# EAGLE design button (EAGLE 7.4.0)
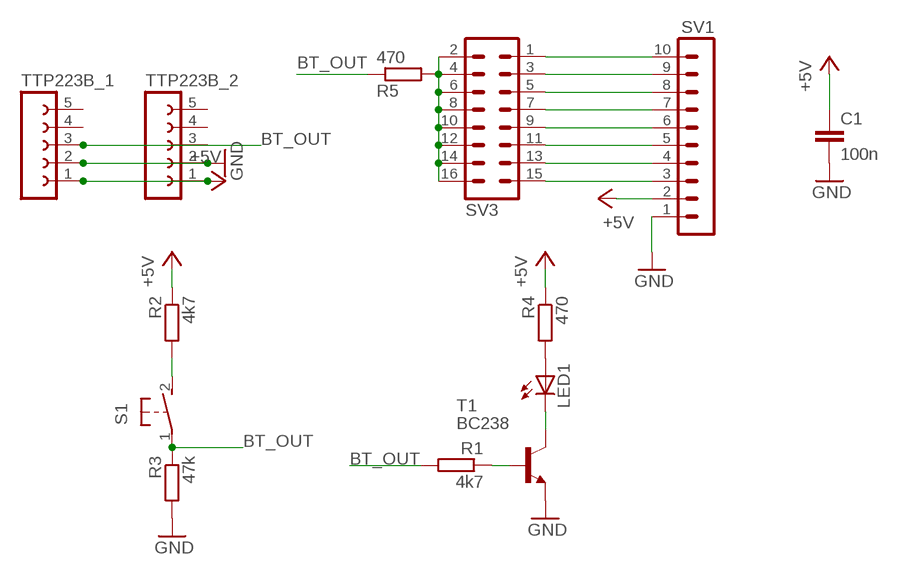
[diagram p0: schematic, sheet 1]

## Parts
C1  100n  C-EU025-024X044  [C025-024X044]
LED1  LED5MM  [LED5MM]
R1  4k7  R-EU_0309/10  [0309/10]
R2  4k7  R-EU_R0805  [R0805]
R3  47k  R-EU_0414/15  [0414/15]
R4  470  R-EU_0207/7  [0207/7]
R5  470  R-EU_0207/7  [0207/7]
S1  31-XX  [B3F-31XX]
SV1  MA10-1W  [MA10-1W]
SV3  MA08-2  [MA08-2]
T1  BC238  -NPN-TO5  [TO5]
TTP223B_1  FE05-1  [FE05-1]
TTP223B_2  FE05W  [FE05W]

## Nets
+5V: C1.1 R2.1 R4.1 SV1.2 TTP223B_1.1 TTP223B_2.1
BT_OUT: R1.2 R3.1 R5.1 S1.1(P) TTP223B_1.3 TTP223B_2.3
GND: C1.2 R3.2 SV1.1 T1.1(E) TTP223B_1.2 TTP223B_2.2
N$1: R5.2 SV3.2 SV3.4 SV3.6 SV3.8 SV3.10 SV3.12 SV3.14 SV3.16
N$2: LED1.K(C) T1.3(C)
N$3: R1.1 T1.2(B)
N$4: R2.2 S1.2(S)
N$5: LED1.A R4.2
N$6: SV1.3 SV3.15
N$8: SV1.4 SV3.13
N$9: SV1.5 SV3.11
N$11: SV1.6 SV3.9
N$12: SV1.7 SV3.7
N$13: SV1.8 SV3.5
N$14: SV1.9 SV3.3
N$15: SV1.10 SV3.1
Unconnected: TTP223B_1.4 TTP223B_1.5 TTP223B_2.4 TTP223B_2.5

## Library data of the parts
C1 = rcl:C-EU: CAPACITOR, European symbol
LED1 = led:LED: LED OSRAM: - CHIPLED LG R971, LG N971, LY N971, LG Q971, LY Q971, LO R971, LY R971 LH N974, LH R974 LS Q976, LO Q976, LY Q976 LO Q996 - Hyper CHIPLED LW Q18S LB Q993, LB Q99A, LB R99A - SideLED LS A670, LO A670, LY A670, LG A670, LP A670 LB A673, LV A673, LT A673, LW A673 LH A674 LY A675 LS A676, LA A676, LO A676, LY A676, LW A676 LS A679, LY A679, LG A679 - Hyper Micro SIDELED® LS Y876, LA Y876, LO Y876, LY Y876 LT Y87S - SmartLED LW L88C, LW L88S LB L89C, LB L89S, LG L890 LS L89K, LO L89K, LY L89K LS L896, LA L896, LO L896, LY L896 - TOPLED LS T670, LO T670, LY T670, LG T670, LP T670 LSG T670, LSP T670, LSY T670, LOP T670, LYG T670 LG T671, LOG T671, LSG T671 LB T673, LV T673, LT T673, LW T673 LH T674 LS T676, LA T676, LO T676, LY T676, LB T676, LH T676, LSB T676, LW T676 LB T67C, LV T67C, LT T67C, LS T67K, LO T67K, LY T67K, LW E67C LS E67B, LA E67B, LO E67B, LY E67B, LB E67C, LV E67C, LT E67C LW T67C LS T679, LY T679, LG T679 LS T770, LO T770, LY T770, LG T770, LP T770 LB T773, LV T773, LT T773, LW T773 LH T774 LS E675, LA E675, LY E675, LS T675 LS T776, LA T776, LO T776, LY T776, LB T776 LHGB T686 LT T68C, LB T68C - Hyper Mini TOPLED® LB M676 - Mini TOPLED Santana® LG M470 LS M47K, LO M47K, LY M47K Source: http://www.osram.convergy.de LUXEON: - LUMILED® LXK2-PW12-R00, LXK2-PW12-S00, LXK2-PW14-U00, LXK2-PW14-V00 LXK2-PM12-R00, LXK2-PM12-S00, LXK2-PM14-U00 LXK2-PE12-Q00, LXK2-PE12-R00, LXK2-PE12-S00, LXK2-PE14-T00, LXK2-PE14-U00 LXK2-PB12-K00, LXK2-PB12-L00, LXK2-PB12-M00, LXK2-PB14-N00, LXK2-PB14-P00, LXK2-PB14-Q00 LXK2-PR12-L00, LXK2-PR12-M00, LXK2-PR14-Q00, LXK2-PR14-R00 LXK2-PD12-Q00, LXK2-PD12-R00, LXK2-PD12-S00 LXK2-PH12-R00, LXK2-PH12-S00 LXK2-PL12-P00, LXK2-PL12-Q00, LXK2-PL12-R00 Source: www.luxeon.com KINGBRIGHT: KA-3528ASYC Source: www.kingbright.com
R1-R5 = rcl:R-EU_: RESISTOR, European symbol
S1 = switch-omron:31-XX: OMRON SWITCH; MPN: B3F-3100; OC_FARNELL: 959704; OC_NEWARK: 36M3582
SV1 = con-lstb:MA10-1W: PIN HEADER
SV3 = con-lstb:MA08-2: PIN HEADER
T1 = transistor:*-NPN-: NPN Transistror BF959 corrected 2008.03.06
TTP223B_1 = con-lsta:FE05-1: FEMALE HEADER; OC_FARNELL: unknown; OC_NEWARK: unknown
TTP223B_2 = con-lsta:FE05W: FEMALE HEADER; OC_FARNELL: unknown; OC_NEWARK: unknown

## Board
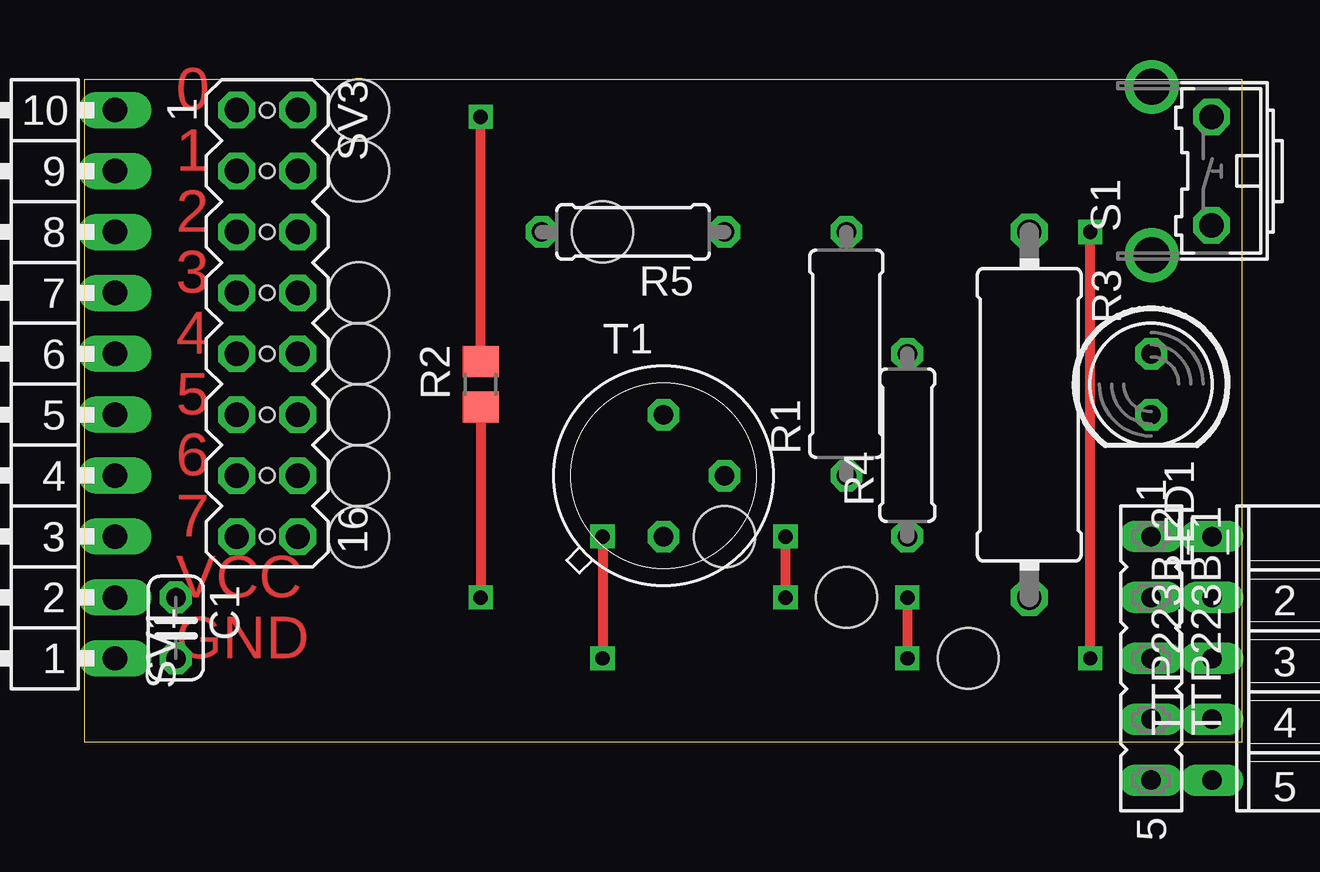
[diagram p1: board, top side]
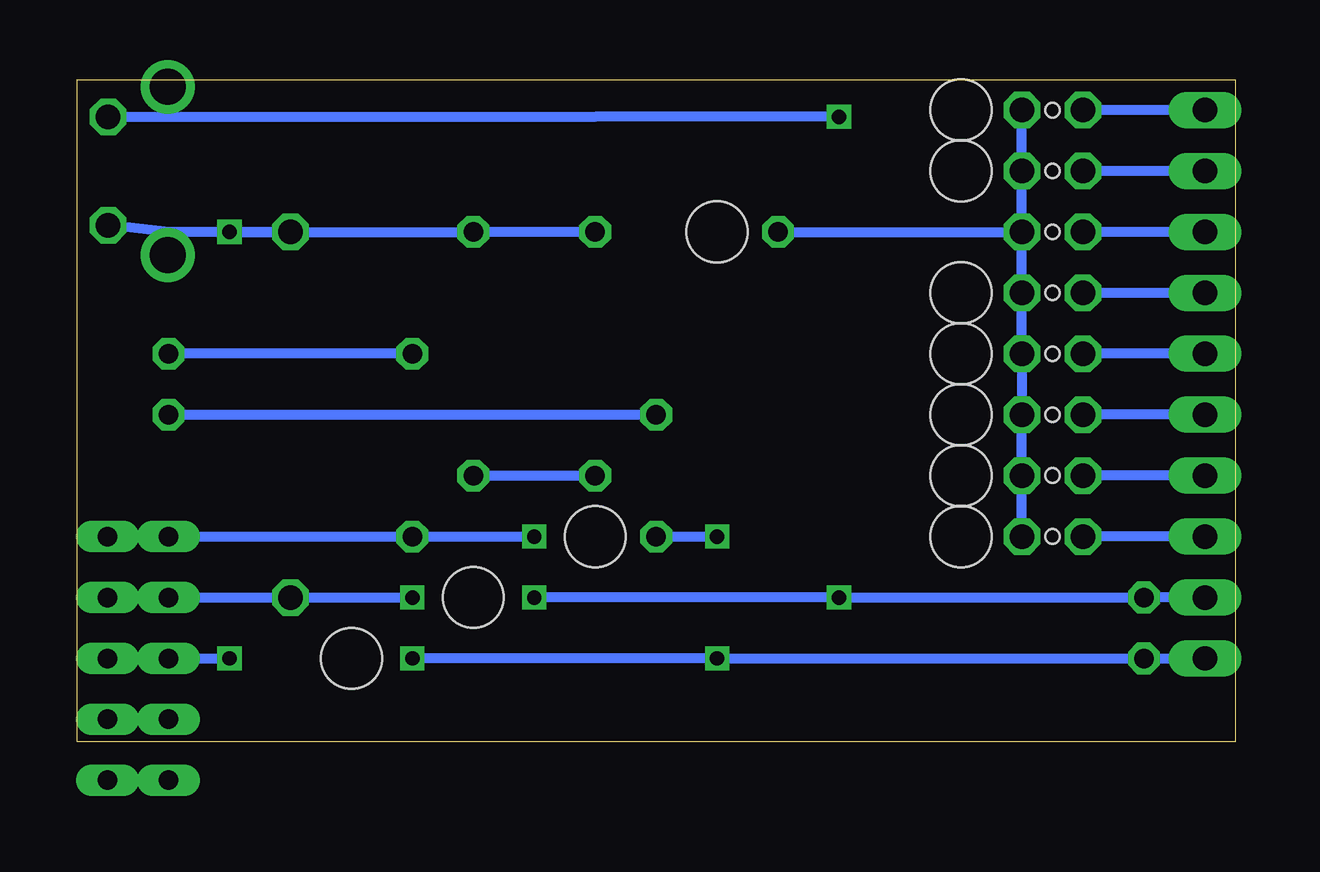
[diagram p2: board, bottom side, seen from below]

Size 48.25 x 27.61 mm. Coordinates in mm from the lower left corner, seen from the top.
Outline: 0,27.61 0,0 48.25,0 48.25,27.61 0,27.61
Copper layers (1*16): Top 0.035mm / dielectric 1.5mm / Bottom 0.035mm
Design rules "default": minimum track width 10mil, minimum drill 24mil, track to track 8mil, track to pad 8mil, pad to pad 8mil, via to via 8mil, smd to smd 8mil, copper to edge 40mil, drill to drill 8mil, minimum pad ring 10mil, minimum via ring 8mil, stop-mask expansion 4mil, vias tented up to drill 0mil, thermal gap 10mil
Holes 2.54 mm at 11.43,18.72 11.43,16.18 11.43,13.64 11.43,11.1 11.43,8.56 31.75,6.02 36.83,3.48 26.67,8.56 11.43,23.8 11.43,26.34 21.59,21.26
Holes 0.6 mm at 7.62,26.34 7.62,23.8 7.62,21.26 7.62,18.72 7.62,16.18 7.62,13.64 7.62,11.1 7.62,8.56

### Footprints (pad centres in the part's own frame; a part is rotated, then mirrored left to right if it is on the bottom)
C025-024X044 = drill 0.813 octagon: 1 -1.27,0; 2 1.27,0
LED5MM = drill 0.813 octagon: A -1.27,0; K 1.27,0
0309/10 = drill 0.813 octagon: 1 -5.08,0; 2 5.08,0
R0805 = smd 1.3 x 1.5: 1 -0.95,0; 2 0.95,0
0414/15 = drill 1.016 octagon: 1 -7.62,0; 2 7.62,0
0207/7 = drill 0.813 octagon: 1 -3.81,0; 2 3.81,0
B3F-31XX = drill 1.016 octagon: 1 -2.261,-1.245; 2 2.261,-1.245 | drill 1.499 pad 2.159: 3 -3.505,1.245; 4 3.505,1.245
MA10-1W = drill 1.016 long: 1 -11.43,0; 2 -8.89,0; 3 -6.35,0; 4 -3.81,0; 5 -1.27,0; 6 1.27,0; 7 3.81,0; 8 6.35,0; 9 8.89,0; 10 11.43,0
MA08-2 = drill 1.016 octagon: 1 -8.89,-1.27; 2 -8.89,1.27; 3 -6.35,-1.27; 4 -6.35,1.27; 5 -3.81,-1.27; 6 -3.81,1.27; 7 -1.27,-1.27; 8 -1.27,1.27; 9 1.27,-1.27; 10 1.27,1.27; 11 3.81,-1.27; 12 3.81,1.27; 13 6.35,-1.27; 14 6.35,1.27; 15 8.89,-1.27; 16 8.89,1.27
TO5 = drill 0.813 octagon: 1 0,-2.54; 2 2.54,0; 3 0,2.54
FE05-1 = drill 0.813 long: 1 -5.08,0; 2 -2.54,0; 3 0,0; 4 2.54,0; 5 5.08,0
FE05W = drill 0.813 long: 1 -5.08,0; 2 -2.54,0; 3 0,0; 4 2.54,0; 5 5.08,0

### Placement (x,y rotation side)
C1  3.81,4.75 270 top
LED1  44.45,14.91 270 top
R1  31.75,16.18 90 top
R2  16.51,14.91 90 top
R3  39.37,13.64 270 top
R4  34.29,12.37 90 top
R5  22.86,21.26 180 top
S1  45.72,23.8 90 top
SV1  1.27,14.91 90 top
SV3  7.62,17.45 270 top
T1  24.13,11.1 0 top
TTP223B_1  44.45,3.48 270 top
TTP223B_2  46.99,3.48 270 top

### Tracks (layer width: path | path; a pad name or v marks a point on that pad's centre or on a via)
+5V  (via drill 0.6)
  Top 0.406: v29.21,8.56 v29.21,6.02 | R2.1 v16.51,6.02
  Bottom 0.406: SV1.2 C1.1 v16.51,6.02 v29.21,6.02 | v29.21,8.56 R4.1 TTP223B_1.1 TTP223B_2.1
BT_OUT  (via drill 0.6)
  Top 0.406: v41.91,3.48 v41.91,21.26
  Bottom 0.406: S1.1 44.42,21.26 R3.1 R1.2 | v41.91,3.48 TTP223B_1.3 TTP223B_2.3 | v41.91,21.26 R1.2 | R5.1 R1.2
GND  (via drill 0.6)
  Top 0.406: v34.29,6.02 v34.29,3.48 | v21.59,8.56 v21.59,3.48
  Bottom 0.406: SV1.1 C1.2 v21.59,3.48 v34.29,3.48 | v34.29,6.02 R3.2 TTP223B_1.2 TTP223B_2.2 | T1.1 v21.59,8.56
N$1
  Bottom 0.406: R5.2 SV3.6 | SV3.16 SV3.14 SV3.12 SV3.10 SV3.8 SV3.6 | SV3.6 SV3.4 SV3.2
N$2
  Bottom 0.406: LED1.K T1.3
N$3
  Bottom 0.406: R1.1 T1.2
N$4  (via drill 0.6)
  Top 0.406: R2.2 v16.51,26.06
  Bottom 0.406: S1.2 26.67,26.06 v16.51,26.06
N$5
  Bottom 0.406: R4.2 LED1.A
N$6
  Bottom 0.406: SV1.3 SV3.15
N$8
  Bottom 0.406: SV1.4 SV3.13
N$9
  Bottom 0.406: SV1.5 SV3.11
N$11
  Bottom 0.406: SV1.6 SV3.9
N$12
  Bottom 0.406: SV1.7 SV3.7
N$13
  Bottom 0.406: SV1.8 SV3.5
N$14
  Bottom 0.406: SV1.9 SV3.3
N$15
  Bottom 0.406: SV1.10 SV3.1

### Text on the board
Top: 0 | 1 | 2 | 3 | 4 | 5 | 6 | 7 | VCC | GND
tDocu: TTP223B